# Altium schematic sheet heater-selection.SchDoc
size A4
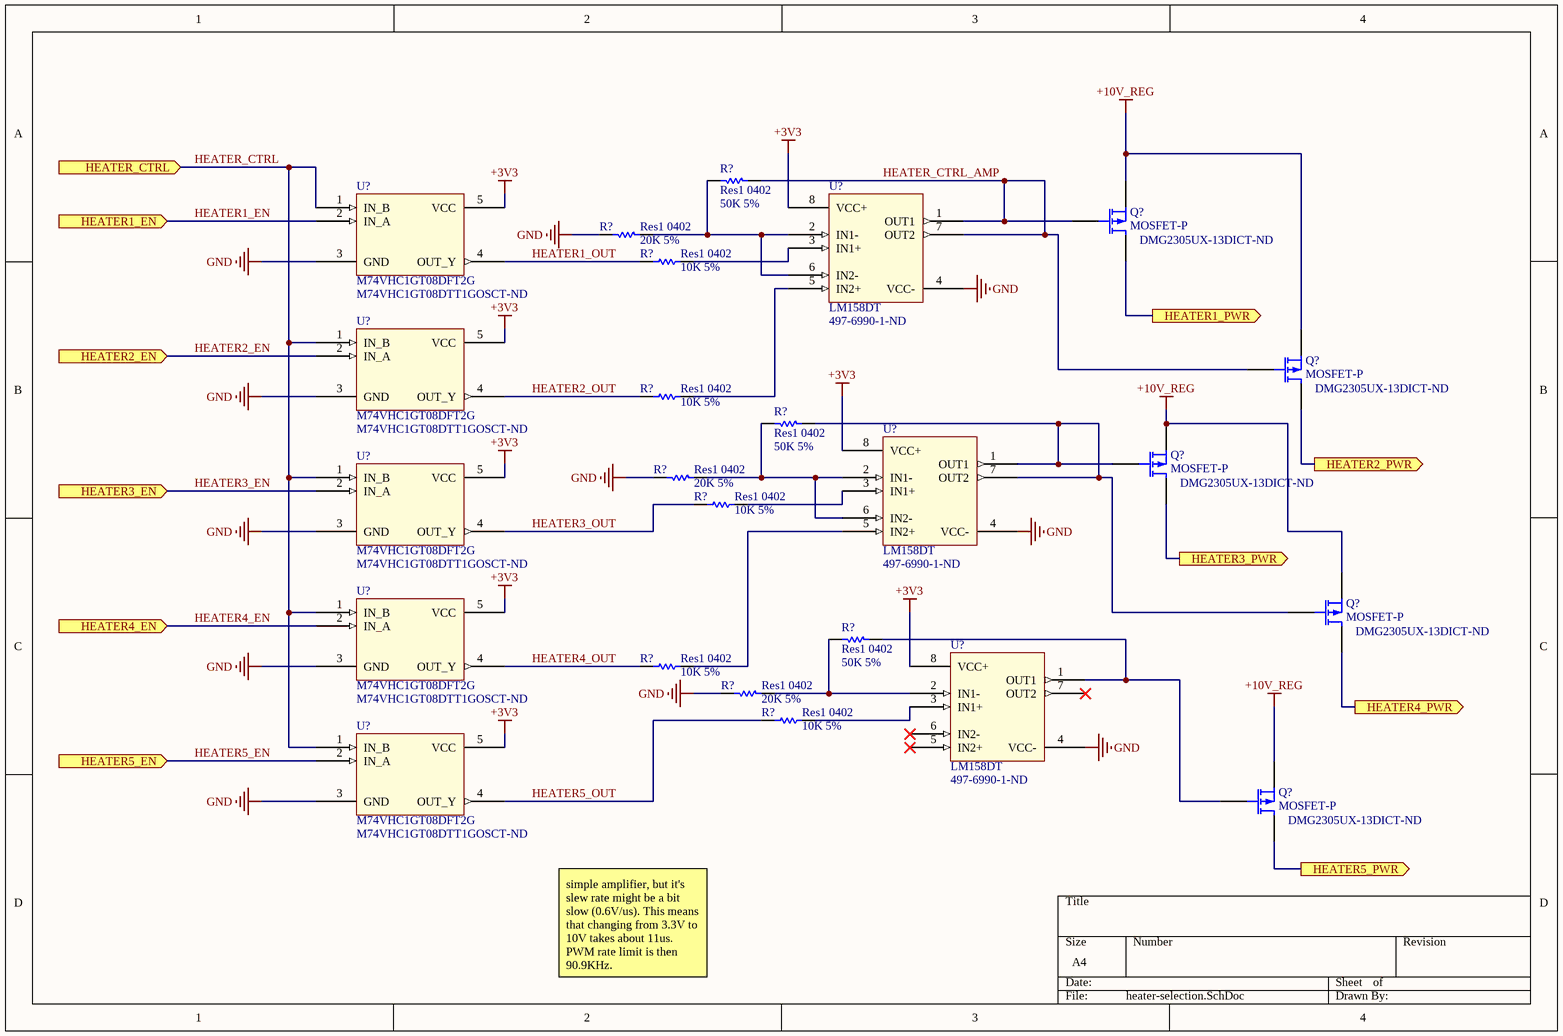
[diagram p0: heater-selection.SchDoc]

## Parts
(Parts that share a designator on the sheet are numbered #1, #2 ... from top to bottom, then left to right.)
Q?#1  MOSFET-P  Supplier Part Number 1: DMG2305UX-13DICT-ND
Q?#2  MOSFET-P  Supplier Part Number 1: DMG2305UX-13DICT-ND
Q?#3  MOSFET-P  Supplier Part Number 1: DMG2305UX-13DICT-ND
Q?#4  MOSFET-P  Supplier Part Number 1: DMG2305UX-13DICT-ND
Q?#5  MOSFET-P  Supplier Part Number 1: DMG2305UX-13DICT-ND
R?#1  Res1 0402  value 50K 5%  [AXIAL-0.3]
R?#2  Res1 0402  value 20K 5%  [AXIAL-0.3]
R?#3  Res1 0402  value 10K 5%  [AXIAL-0.3]
R?#4  Res1 0402  value 10K 5%  [AXIAL-0.3]
R?#5  Res1 0402  value 50K 5%  [AXIAL-0.3]
R?#6  Res1 0402  value 20K 5%  [AXIAL-0.3]
R?#7  Res1 0402  value 10K 5%  [AXIAL-0.3]
R?#8  Res1 0402  value 50K 5%  [AXIAL-0.3]
R?#9  Res1 0402  value 10K 5%  [AXIAL-0.3]
R?#10  Res1 0402  value 20K 5%  [AXIAL-0.3]
R?#11  Res1 0402  value 10K 5%  [AXIAL-0.3]
U?#1  LM158DT  Supplier Part Number 1: 497-6990-1-ND  [SOIC127P500X600-8N]
U?#2  M74VHC1GT08DFT2G  Supplier Part Number 1: M74VHC1GT08DTT1GOSCT-ND  [SOT-25]
U?#3  M74VHC1GT08DFT2G  Supplier Part Number 1: M74VHC1GT08DTT1GOSCT-ND  [SOT-25]
U?#4  LM158DT  Supplier Part Number 1: 497-6990-1-ND  [SOIC127P500X600-8N]
U?#5  M74VHC1GT08DFT2G  Supplier Part Number 1: M74VHC1GT08DTT1GOSCT-ND  [SOT-25]
U?#6  M74VHC1GT08DFT2G  Supplier Part Number 1: M74VHC1GT08DTT1GOSCT-ND  [SOT-25]
U?#7  LM158DT  Supplier Part Number 1: 497-6990-1-ND  [SOIC127P500X600-8N]
U?#8  M74VHC1GT08DFT2G  Supplier Part Number 1: M74VHC1GT08DTT1GOSCT-ND  [SOT-25]

## Ports
HEATER1_EN (in), HEATER1_PWR (out), HEATER2_EN (in), HEATER2_PWR (out), HEATER3_EN (in), HEATER3_PWR (out), HEATER4_EN (in), HEATER4_PWR (out), HEATER5_EN (in), HEATER5_PWR (out), HEATER_CTRL (in)

## Nets
+3V3: U?#1.8(VCC+) U?#2.5(VCC) U?#3.5(VCC) U?#4.8(VCC+) U?#5.5(VCC) U?#6.5(VCC) U?#7.8(VCC+) U?#8.5(VCC)
+10V_REG: Q?#1.3(S) Q?#2.3(S) Q?#3.3(S) Q?#4.3(S) Q?#5.3(S)
GND: R?#2.2 R?#6.2 R?#10.2 U?#1.4(VCC-) U?#2.3(GND) U?#3.3(GND) U?#4.4(VCC-) U?#5.3(GND) U?#6.3(GND) U?#7.4(VCC-) U?#8.3(GND)
HEATER1_EN: U?#2.2(IN_A) ; port HEATER1_EN
HEATER1_OUT: R?#3.2 U?#2.4(OUT_Y)
HEATER1_PWR: Q?#1.1(D) ; port HEATER1_PWR
HEATER2_EN: U?#3.2(IN_A) ; port HEATER2_EN
HEATER2_OUT: R?#4.2 U?#3.4(OUT_Y)
HEATER2_PWR: Q?#2.1(D) ; port HEATER2_PWR
HEATER3_EN: U?#5.2(IN_A) ; port HEATER3_EN
HEATER3_OUT: R?#7.2 U?#5.4(OUT_Y)
HEATER3_PWR: Q?#3.1(D) ; port HEATER3_PWR
HEATER4_EN: U?#6.2(IN_A) ; port HEATER4_EN
HEATER4_OUT: R?#9.2 U?#6.4(OUT_Y)
HEATER4_PWR: Q?#4.1(D) ; port HEATER4_PWR
HEATER5_EN: U?#8.2(IN_A) ; port HEATER5_EN
HEATER5_OUT: R?#11.2 U?#8.4(OUT_Y)
HEATER5_PWR: Q?#5.1(D) ; port HEATER5_PWR
HEATER_CTRL: U?#2.1(IN_B) U?#3.1(IN_B) U?#5.1(IN_B) U?#6.1(IN_B) U?#8.1(IN_B) ; port HEATER_CTRL
HEATER_CTRL_AMP: Q?#1.2(G) Q?#2.2(G) R?#1.1 U?#1.1(OUT1) U?#1.7(OUT2)
NetQ?#3_2: Q?#3.2(G) Q?#4.2(G) R?#5.1 U?#4.1(OUT1) U?#4.7(OUT2)
NetQ?#5_2: Q?#5.2(G) R?#8.1 U?#7.1(OUT1)
NetR?#1_2: R?#1.2 R?#2.1 U?#1.2(IN1-) U?#1.6(IN2-)
NetR?#3_1: R?#3.1 U?#1.3(IN1+)
NetR?#4_1: R?#4.1 U?#1.5(IN2+)
NetR?#5_2: R?#5.2 R?#6.1 U?#4.2(IN1-) U?#4.6(IN2-)
NetR?#7_1: R?#7.1 U?#4.3(IN1+)
NetR?#8_2: R?#8.2 R?#10.1 U?#7.2(IN1-)
NetR?#9_1: R?#9.1 U?#4.5(IN2+)
NetR?#11_1: R?#11.1 U?#7.3(IN1+)

Not connected (* = marked no-connect by the designer): U?#7 5(IN2+)* 6(IN2-)* 7(OUT2)*

## Notes on the sheet
- simple amplifier, but it's slew rate might be a bit slow (0.6V/us). This means that changing from 3.3V to 10V takes about 11us. PWM rate limit is then 90.9KHz.

## Library data of the parts
Q?#1-Q?#5 = MOSFET-P: P-Channel MOSFET; Published: 8-Jun-2000; LatestRevisionDate: 17-Jul-2002; LatestRevisionNote: Re-released for DXP Platform.; PackageVersion: 1995/1996; PackageReference: E3; Publisher: Altium Limited; PackageDescription: TO, Flat Index; 3 In-Line, Axial Leads; Body Dia. 4.6mm; Lead Dia. 0.5 mm (max); Supplier 1: Digi-Key
R?#1-R?#11 = Res1: Resistor; Published: 8-Jun-2000; LatestRevisionDate: 17-Jul-2002; LatestRevisionNote: Re-released for DXP Platform.; PackageReference: AXIAL-0.3; Publisher: Altium Limited; PackageDescription: Axial Device, Thru-Hole; 2 Leads; 0.3 in Pin Spacing
U?#1 U?#4 U?#7 = LM158: General Purpose Amplifier 2 Circuit 8-SOIC, operating temperature range -55°C ~ 125°C; ComponentLink1Description: Datasheet; ComponentLink1URL: https://www.st.com/content/ccc/resource/technical/document/datasheet/61/46/87/01/98/ed/44/c5/CD00000464.pdf/files/CD00000464.pdf/jcr:content/translations/en.CD00000464.pdf; Supplier 1: Digi-Key
U?#2 U?#3 U?#5 U?#6 U?#8 = MC74VHC1GT08: AND Gate IC 1 Channel SC-88A (SC-70-5/SOT-353); Supplier 1: Digi-Key; ComponentLink1Description: Datasheet; ComponentLink1URL: https://www.onsemi.com/pub/Collateral/MC74VHC1GT08-D.PDF